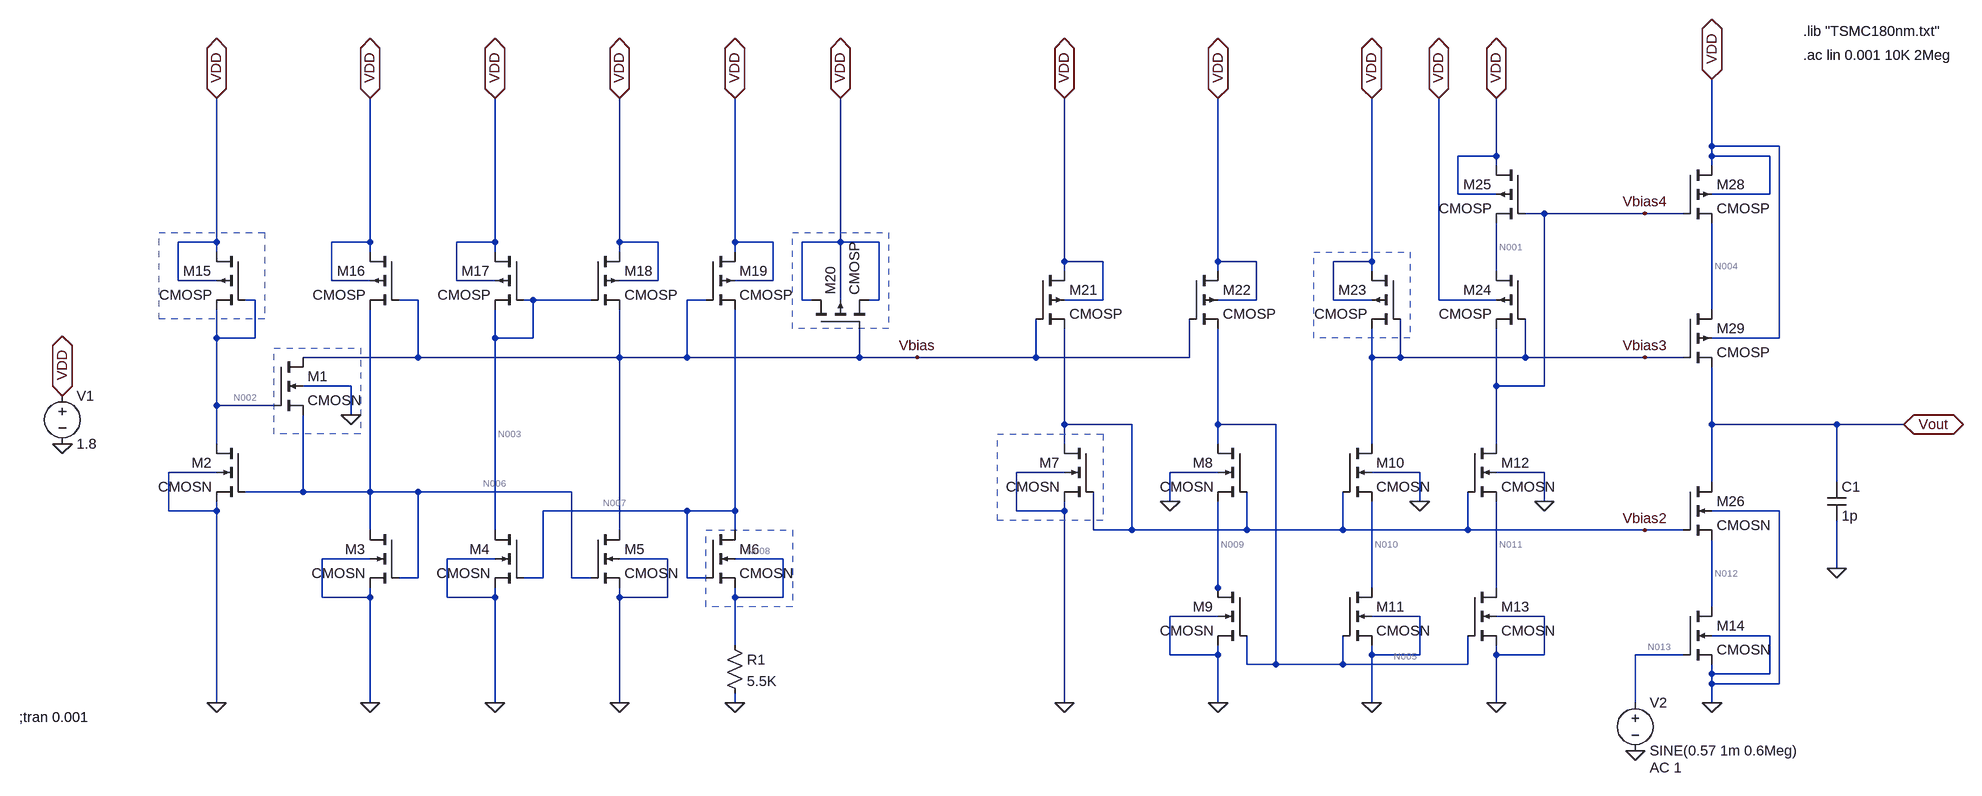
[diagram p0: schematic 180nmSpice.asc]
180nmSpice.asc, the LTspice schematic file:
Version 4
SHEET 1 3488 724
WIRE 2336 -368 2336 -480
WIRE 2448 -368 2336 -368
WIRE 1840 -352 1840 -448
WIRE 1840 -352 1776 -352
WIRE 2336 -352 2336 -368
WIRE 2432 -352 2336 -352
WIRE 1840 -336 1840 -352
WIRE 2336 -336 2336 -352
WIRE 1776 -288 1776 -352
WIRE 1840 -288 1776 -288
WIRE 2432 -288 2432 -352
WIRE 2432 -288 2336 -288
WIRE 1920 -256 1888 -256
WIRE 2224 -256 1920 -256
WIRE 2288 -256 2224 -256
WIRE -352 -208 -352 -448
WIRE -352 -208 -416 -208
WIRE -96 -208 -96 -448
WIRE -96 -208 -160 -208
WIRE 112 -208 112 -448
WIRE 112 -208 48 -208
WIRE 320 -208 320 -448
WIRE 384 -208 320 -208
WIRE 512 -208 512 -448
WIRE 576 -208 512 -208
WIRE 688 -208 688 -448
WIRE 688 -208 624 -208
WIRE 752 -208 688 -208
WIRE -352 -192 -352 -208
WIRE -96 -192 -96 -208
WIRE 112 -192 112 -208
WIRE 320 -192 320 -208
WIRE 512 -192 512 -208
WIRE 1120 -176 1120 -448
WIRE 1184 -176 1120 -176
WIRE 1376 -176 1376 -448
WIRE 1440 -176 1376 -176
WIRE 1632 -176 1632 -448
WIRE 1632 -176 1568 -176
WIRE 1120 -160 1120 -176
WIRE 1376 -160 1376 -176
WIRE 1632 -160 1632 -176
WIRE 1840 -160 1840 -240
WIRE -416 -144 -416 -208
WIRE -352 -144 -416 -144
WIRE -160 -144 -160 -208
WIRE -96 -144 -160 -144
WIRE 48 -144 48 -208
WIRE 112 -144 48 -144
WIRE 384 -144 384 -208
WIRE 384 -144 320 -144
WIRE 576 -144 576 -208
WIRE 576 -144 512 -144
WIRE -288 -112 -304 -112
WIRE -16 -112 -48 -112
WIRE 176 -112 160 -112
WIRE 272 -112 176 -112
WIRE 464 -112 432 -112
WIRE 624 -112 624 -208
WIRE 640 -112 624 -112
WIRE 688 -112 688 -208
WIRE 752 -112 752 -208
WIRE 752 -112 736 -112
WIRE 1184 -112 1184 -176
WIRE 1184 -112 1120 -112
WIRE 1440 -112 1440 -176
WIRE 1440 -112 1376 -112
WIRE 1568 -112 1568 -176
WIRE 1632 -112 1568 -112
WIRE 1744 -112 1744 -448
WIRE 1840 -112 1744 -112
WIRE 2336 -96 2336 -240
WIRE -352 -48 -352 -96
WIRE -288 -48 -288 -112
WIRE -288 -48 -352 -48
WIRE 112 -48 112 -96
WIRE 176 -48 176 -112
WIRE 176 -48 112 -48
WIRE 2448 -48 2448 -368
WIRE 2448 -48 2336 -48
WIRE -16 -16 -16 -112
WIRE -16 -16 -208 -16
WIRE 320 -16 320 -96
WIRE 320 -16 -16 -16
WIRE 432 -16 432 -112
WIRE 432 -16 320 -16
WIRE 720 -16 720 -64
WIRE 720 -16 432 -16
WIRE 816 -16 720 -16
WIRE 1072 -16 1072 -80
WIRE 1072 -16 816 -16
WIRE 1328 -16 1328 -80
WIRE 1328 -16 1072 -16
WIRE 1632 -16 1632 -64
WIRE 1680 -16 1680 -80
WIRE 1680 -16 1632 -16
WIRE 1888 -16 1888 -80
WIRE 1888 -16 1680 -16
WIRE 2224 -16 1888 -16
WIRE 2288 -16 2224 -16
WIRE -128 32 -208 32
WIRE 1840 32 1840 -64
WIRE 1920 32 1920 -256
WIRE 1920 32 1840 32
WIRE -352 64 -352 -48
WIRE -256 64 -352 64
WIRE -128 80 -128 32
WIRE 1120 96 1120 -64
WIRE 1232 96 1120 96
WIRE 1376 96 1376 -64
WIRE 1472 96 1376 96
WIRE 2336 96 2336 0
WIRE 2544 96 2336 96
WIRE 2656 96 2544 96
WIRE -352 128 -352 64
WIRE 1120 128 1120 96
WIRE 1376 128 1376 96
WIRE 1632 128 1632 -16
WIRE 1840 128 1840 32
WIRE -352 176 -432 176
WIRE 1120 176 1040 176
WIRE 1376 176 1296 176
WIRE 1712 176 1632 176
WIRE 1920 176 1840 176
WIRE 2336 192 2336 96
WIRE 2544 192 2544 96
WIRE -208 208 -208 80
WIRE -208 208 -304 208
WIRE -96 208 -96 -96
WIRE -96 208 -208 208
WIRE -16 208 -96 208
WIRE 240 208 -16 208
WIRE 1296 224 1296 176
WIRE 1712 224 1712 176
WIRE 1920 224 1920 176
WIRE -432 240 -432 176
WIRE -352 240 -352 224
WIRE -352 240 -432 240
WIRE 432 240 192 240
WIRE 512 240 512 -96
WIRE 512 240 432 240
WIRE 1040 240 1040 176
WIRE 1120 240 1120 224
WIRE 1120 240 1040 240
WIRE 2448 240 2336 240
WIRE -96 272 -96 208
WIRE 112 272 112 -48
WIRE 320 272 320 -16
WIRE 512 272 512 240
WIRE 1168 272 1168 208
WIRE 1232 272 1232 96
WIRE 1232 272 1168 272
WIRE 1424 272 1424 208
WIRE 1424 272 1232 272
WIRE 1584 272 1584 208
WIRE 1584 272 1424 272
WIRE 1792 272 1792 208
WIRE 1792 272 1584 272
WIRE 2224 272 1792 272
WIRE 2288 272 2224 272
WIRE -96 320 -176 320
WIRE 112 320 32 320
WIRE 400 320 320 320
WIRE 592 320 512 320
WIRE 2544 336 2544 256
WIRE -16 352 -16 208
WIRE -16 352 -48 352
WIRE 192 352 192 240
WIRE 192 352 160 352
WIRE 240 352 240 208
WIRE 272 352 240 352
WIRE 432 352 432 240
WIRE 464 352 432 352
WIRE 1376 368 1376 224
WIRE 1632 368 1632 224
WIRE 1840 368 1840 224
WIRE -176 384 -176 320
WIRE -96 384 -96 368
WIRE -96 384 -176 384
WIRE 32 384 32 320
WIRE 112 384 112 368
WIRE 112 384 32 384
WIRE 320 384 320 368
WIRE 400 384 400 320
WIRE 400 384 320 384
WIRE 512 384 512 368
WIRE 592 384 592 320
WIRE 592 384 512 384
WIRE 1376 384 1376 368
WIRE 2336 400 2336 288
WIRE 1376 416 1296 416
WIRE 1712 416 1632 416
WIRE 1920 416 1840 416
WIRE 2432 448 2336 448
WIRE 512 464 512 384
WIRE 1296 480 1296 416
WIRE 1376 480 1376 464
WIRE 1376 480 1296 480
WIRE 1632 480 1632 464
WIRE 1712 480 1712 416
WIRE 1712 480 1632 480
WIRE 1840 480 1840 464
WIRE 1920 480 1920 416
WIRE 1920 480 1840 480
WIRE 2288 480 2208 480
WIRE 1424 496 1424 448
WIRE 1472 496 1472 96
WIRE 1472 496 1424 496
WIRE 1584 496 1584 448
WIRE 1584 496 1472 496
WIRE 1792 496 1792 448
WIRE 1792 496 1584 496
WIRE 2336 512 2336 496
WIRE 2432 512 2432 448
WIRE 2432 512 2336 512
WIRE 2336 528 2336 512
WIRE 2448 528 2448 240
WIRE 2448 528 2336 528
WIRE -352 560 -352 240
WIRE -96 560 -96 384
WIRE 112 560 112 384
WIRE 320 560 320 384
WIRE 512 560 512 544
WIRE 1120 560 1120 240
WIRE 1376 560 1376 480
WIRE 1632 560 1632 480
WIRE 1840 560 1840 480
WIRE 2208 560 2208 480
WIRE 2336 560 2336 528
FLAG -624 128 0
FLAG -624 48 VDD
IOPIN -624 48 BiDir
FLAG -352 -448 VDD
IOPIN -352 -448 BiDir
FLAG -96 -448 VDD
IOPIN -96 -448 BiDir
FLAG 112 -448 VDD
IOPIN 112 -448 BiDir
FLAG 320 -448 VDD
IOPIN 320 -448 BiDir
FLAG 512 -448 VDD
IOPIN 512 -448 BiDir
FLAG 688 -448 VDD
IOPIN 688 -448 BiDir
FLAG 1120 -448 VDD
IOPIN 1120 -448 BiDir
FLAG 1376 -448 VDD
IOPIN 1376 -448 BiDir
FLAG 1632 -448 VDD
IOPIN 1632 -448 BiDir
FLAG 1840 -448 VDD
IOPIN 1840 -448 BiDir
FLAG -352 560 0
FLAG -96 560 0
FLAG 112 560 0
FLAG 320 560 0
FLAG 512 560 0
FLAG 1120 560 0
FLAG 1376 560 0
FLAG 1632 560 0
FLAG 1840 560 0
FLAG 1920 224 0
FLAG 1712 224 0
FLAG 1296 224 0
FLAG -128 80 0
FLAG 1744 -448 VDD
IOPIN 1744 -448 BiDir
FLAG 2224 -256 Vbias4
FLAG 2224 -16 Vbias3
FLAG 2224 272 Vbias2
FLAG 2336 -480 VDD
IOPIN 2336 -480 BiDir
FLAG 2336 560 0
FLAG 2208 640 0
FLAG 2656 96 Vout
IOPIN 2656 96 BiDir
FLAG 2544 336 0
FLAG 816 -16 Vbias
DATAFLAG 2048 -256 ""
DATAFLAG 2048 -16 ""
DATAFLAG 2048 272 ""
DATAFLAG 944 -16 ""
DATAFLAG 2576 96 ""
DATAFLAG 2208 480 ""
SYMBOL nmos4 -256 -16 R0
SYMATTR InstName M1
SYMATTR Value CMOSN
SYMATTR Value2 l=360n w=720n
SYMBOL nmos4 -304 128 M0
SYMATTR InstName M2
SYMATTR Value CMOSN
SYMATTR Value2 l=360n w=1800n
SYMBOL nmos4 -48 272 M0
SYMATTR InstName M3
SYMATTR Value CMOSN
SYMATTR Value2 l=360n w=1800n
SYMBOL nmos4 160 272 M0
SYMATTR InstName M4
SYMATTR Value CMOSN
SYMATTR Value2 l=360n w=1800n
SYMBOL nmos4 272 272 R0
SYMATTR InstName M5
SYMATTR Value CMOSN
SYMATTR Value2 l=360n w=1800n
SYMBOL nmos4 464 272 R0
SYMATTR InstName M6
SYMATTR Value CMOSN
SYMATTR Value2 l=360n w=5400n
SYMBOL nmos4 1168 128 M0
SYMATTR InstName M7
SYMATTR Value CMOSN
SYMATTR Value2 l=540n w=686n
SYMBOL nmos4 1424 128 M0
SYMATTR InstName M8
SYMATTR Value CMOSN
SYMATTR Value2 l=360n w=1800n
SYMBOL nmos4 1424 368 M0
SYMATTR InstName M9
SYMATTR Value CMOSN
SYMATTR Value2 l=360n w=1800n
SYMBOL nmos4 1584 128 R0
SYMATTR InstName M10
SYMATTR Value CMOSN
SYMATTR Value2 l=360n w=1800n
SYMBOL nmos4 1584 368 R0
SYMATTR InstName M11
SYMATTR Value CMOSN
SYMATTR Value2 l=360n w=2600n
SYMBOL nmos4 1792 128 R0
SYMATTR InstName M12
SYMATTR Value CMOSN
SYMATTR Value2 l=360n w=1800n
SYMBOL nmos4 1792 368 R0
SYMATTR InstName M13
SYMATTR Value CMOSN
SYMATTR Value2 l=360n w=1800n
SYMBOL pmos4 -304 -192 M0
SYMATTR InstName M15
SYMATTR Value CMOSP
SYMATTR Value2 l=3600n w=1800n
SYMBOL pmos4 -48 -192 M0
SYMATTR InstName M16
SYMATTR Value CMOSP
SYMATTR Value2 l=360n w=4320n
SYMBOL pmos4 160 -192 M0
SYMATTR InstName M17
SYMATTR Value CMOSP
SYMATTR Value2 l=360n w=4320n
SYMBOL pmos4 272 -192 R0
SYMATTR InstName M18
SYMATTR Value CMOSP
SYMATTR Value2 l=360n w=4320n
SYMBOL pmos4 464 -192 R0
SYMATTR InstName M19
SYMATTR Value CMOSP
SYMATTR Value2 l=360n w=4320n
SYMBOL pmos4 640 -64 R270
SYMATTR InstName M20
SYMATTR Value CMOSP
SYMATTR Value2 l=9000n w=9000n
SYMBOL pmos4 1072 -160 R0
SYMATTR InstName M21
SYMATTR Value CMOSP
SYMATTR Value2 l=360n w=7380n
SYMBOL pmos4 1328 -160 R0
SYMATTR InstName M22
SYMATTR Value CMOSP
SYMATTR Value2 l=360n w=4320n
SYMBOL pmos4 1680 -160 M0
SYMATTR InstName M23
SYMATTR Value CMOSP
SYMATTR Value2 l=900n w=3600n
SYMBOL pmos4 1888 -160 M0
SYMATTR InstName M24
SYMATTR Value CMOSP
SYMATTR Value2 l=360n w=4320n
SYMBOL pmos4 1888 -336 M0
SYMATTR InstName M25
SYMATTR Value CMOSP
SYMATTR Value2 l=360n w=6840n
SYMBOL voltage -624 32 R0
WINDOW 123 0 0 Left 0
WINDOW 39 0 0 Left 0
SYMATTR InstName V1
SYMATTR Value 1.8
SYMBOL res 496 448 R0
SYMATTR InstName R1
SYMATTR Value 5.5K
SYMBOL voltage 2208 544 R0
WINDOW 123 24 124 Left 2
WINDOW 39 0 0 Left 0
SYMATTR Value2 AC 1
SYMATTR InstName V2
SYMATTR Value SINE(0.57 1m 0.6Meg)
SYMBOL nmos4 2288 400 R0
SYMATTR InstName M14
SYMATTR Value CMOSN
SYMATTR Value2 l=360n w=1400n
SYMBOL nmos4 2288 192 R0
SYMATTR InstName M26
SYMATTR Value CMOSN
SYMATTR Value2 l=360n w=1300n
SYMBOL pmos4 2288 -336 R0
SYMATTR InstName M28
SYMATTR Value CMOSP
SYMATTR Value2 l=360n w=3800n
SYMBOL pmos4 2288 -96 R0
SYMATTR InstName M29
SYMATTR Value CMOSP
SYMATTR Value2 l=360n w=3700n
SYMBOL cap 2528 192 R0
SYMATTR InstName C1
SYMATTR Value 1p
TEXT -696 584 Left 2 !;tran 0.001
TEXT 2488 -560 Left 2 !.lib "TSMC180nm.txt"
TEXT 2488 -520 Left 2 !.ac lin 0.001 10K 2Meg
RECTANGLE Normal -272 -80 -448 -224 2
RECTANGLE Normal -112 112 -256 -32 2
RECTANGLE Normal 608 400 464 272 2
RECTANGLE Normal 768 -64 608 -224 2
RECTANGLE Normal 1184 256 1008 112 2
RECTANGLE Normal 1696 -48 1536 -192 2

The netlist it stands for:
* 180nmSpice.asc
M1 Vbias N002 N006 0 CMOSN l=360n w=720n
M2 N002 N006 0 0 CMOSN l=360n w=1800n
M3 N006 N006 0 0 CMOSN l=360n w=1800n
M4 N003 N007 0 0 CMOSN l=360n w=1800n
M5 Vbias N006 0 0 CMOSN l=360n w=1800n
M6 N007 N007 N008 N008 CMOSN l=360n w=5400n
M7 Vbias2 Vbias2 0 0 CMOSN l=540n w=686n
M8 N005 Vbias2 N009 0 CMOSN l=360n w=1800n
M9 N009 N005 0 0 CMOSN l=360n w=1800n
M10 Vbias3 Vbias2 N010 0 CMOSN l=360n w=1800n
M11 N010 N005 0 0 CMOSN l=360n w=2600n
M12 Vbias4 Vbias2 N011 0 CMOSN l=360n w=1800n
M13 N011 N005 0 0 CMOSN l=360n w=1800n
M15 VDD N002 N002 VDD CMOSP l=3600n w=1800n
M16 VDD Vbias N006 VDD CMOSP l=360n w=4320n
M17 VDD N003 N003 VDD CMOSP l=360n w=4320n
M18 VDD N003 Vbias VDD CMOSP l=360n w=4320n
M19 VDD Vbias N007 VDD CMOSP l=360n w=4320n
M20 VDD Vbias VDD VDD CMOSP l=9000n w=9000n
M21 VDD Vbias Vbias2 VDD CMOSP l=360n w=7380n
M22 VDD Vbias N005 VDD CMOSP l=360n w=4320n
M23 VDD Vbias3 Vbias3 VDD CMOSP l=900n w=3600n
M24 N001 Vbias3 Vbias4 VDD CMOSP l=360n w=4320n
M25 VDD Vbias4 N001 VDD CMOSP l=360n w=6840n
V1 VDD 0 1.8
R1 N008 0 5.5K
V2 N013 0 SINE(0.57 1m 0.6Meg) AC 1
M14 N012 N013 0 0 CMOSN l=360n w=1400n
M26 Vout Vbias2 N012 0 CMOSN l=360n w=1300n
M28 VDD Vbias4 N004 VDD CMOSP l=360n w=3800n
M29 N004 Vbias3 Vout VDD CMOSP l=360n w=3700n
C1 Vout 0 1p
.model NMOS NMOS
.model PMOS PMOS
.lib standard.mos
;tran 0.001
.lib "TSMC180nm.txt"
.ac lin 0.001 10K 2Meg
.backanno
.end

* Results of the author's LTspice run, read from the files saved beside the schematic
* Operating Point, zero values left out:
*   V(vbias) = 1.197 V
*   V(n002) = 443.6 mV
*   V(n006) = 581.1 mV
*   V(n003) = 1.183 V
*   V(n007) = 581.4 mV
*   V(n008) = 61.29 mV
*   V(vbias2) = 770.3 mV
*   V(n005) = 591.8 mV
*   V(n009) = 148 mV
*   V(vbias3) = 1.013 V
*   V(n010) = 133.3 mV
*   V(vbias4) = 1.215 V
*   V(n011) = 153.2 mV
*   V(vdd) = 1.8 V
*   V(n001) = 1.664 V
*   V(n013) = 570 mV
*   V(n012) = 142.4 mV
*   V(vout) = 221.4 mV
*   V(n004) = 1.632 V
*   Id(M1) = 1.207 pA
*   Ib(M1) = -1.798 pA
*   Id(M2) = 10.86 µA
*   Is(M2) = -10.86 µA
*   Id(M3) = 11.14 µA
*   Is(M3) = -11.14 µA
*   Id(M4) = 12.23 µA
*   Ib(M4) = -1.193 pA
*   Is(M4) = -12.23 µA
*   Id(M5) = 12.21 µA
*   Ib(M5) = -1.207 pA
*   Is(M5) = -12.21 µA
*   Id(M6) = 11.14 µA
*   Is(M6) = -11.14 µA
*   Id(M7) = 18.56 µA
*   Is(M7) = -18.56 µA
*   Id(M8) = 11.13 µA
*   Is(M8) = -11.13 µA
*   Id(M9) = 11.13 µA
*   Is(M9) = -11.13 µA
*   Id(M10) = 15.33 µA
*   Ib(M10) = -1.166 pA
*   Is(M10) = -15.33 µA
*   Id(M11) = 15.33 µA
*   Is(M11) = -15.33 µA
*   Id(M12) = 11.2 µA
*   Ib(M12) = -1.388 pA
*   Is(M12) = -11.2 µA
*   Id(M13) = 11.2 µA
*   Is(M13) = -11.2 µA
*   Id(M14) = 6.51 µA
*   Is(M14) = -6.51 µA
*   Id(M26) = 6.51 µA
*   Is(M26) = -6.51 µA
*   Id(M15) = 10.86 µA
*   Ib(M15) = 1.366 pA
*   Is(M15) = -10.86 µA
*   Id(M16) = 11.14 µA
*   Ib(M16) = 1.229 pA
*   Is(M16) = -11.14 µA
*   Id(M17) = 12.23 µA
*   Is(M17) = -12.23 µA
*   Id(M18) = 12.21 µA
*   Is(M18) = -12.21 µA
*   Id(M19) = 11.14 µA
*   Ib(M19) = 1.229 pA
*   Is(M19) = -11.14 µA
*   Id(M21) = 18.56 µA
*   Ib(M21) = 1.04 pA
*   Is(M21) = -18.56 µA
*   Id(M22) = 11.13 µA
*   Ib(M22) = 1.218 pA
*   Is(M22) = -11.13 µA
*   Id(M23) = 15.33 µA
*   Is(M23) = -15.33 µA
*   Id(M24) = 11.2 µA
*   Is(M24) = -11.2 µA
*   Id(M25) = 11.2 µA
*   Is(M25) = -11.2 µA
*   Id(M28) = 6.51 µA
*   Is(M28) = -6.51 µA
*   Id(M29) = 6.51 µA
*   Ib(M29) = 1.766 pA
*   Is(M29) = -6.51 µA
*   I(R1) = 11.14 µA
*   I(V1) = -120.3 µA
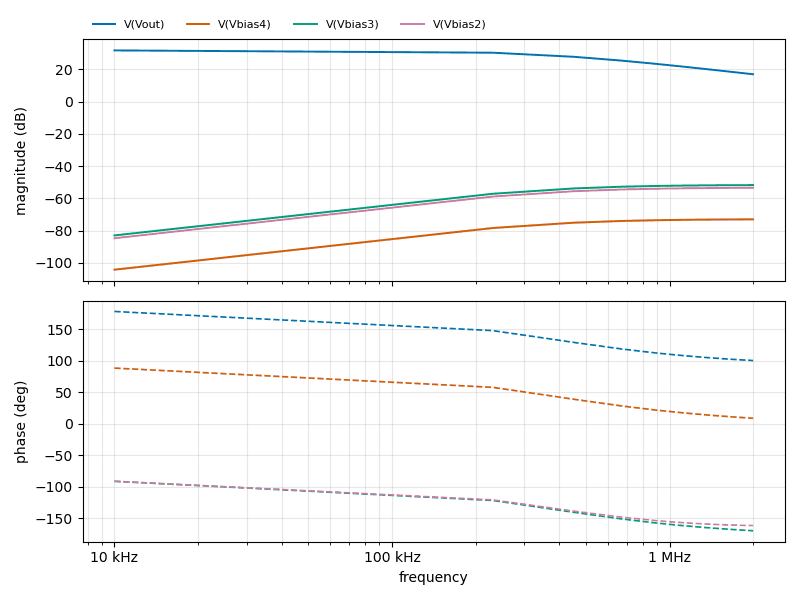
[diagram p1: AC Analysis of 180nmSpice.asc, plotted from the saved traces]
* AC Analysis, 1 run:
*   V(Vout): 31.78 dB at 10 kHz, 16.98 dB at 2 MHz, peak 31.78 dB at 10 kHz, 3 dB below the peak at 351.3 kHz
*   V(Vbias4): -104.21 dB at 10 kHz, -72.99 dB at 2 MHz, peak -72.99 dB at 2 MHz, 3 dB below the peak at 373.9 kHz
*   V(Vbias3): -82.96 dB at 10 kHz, -51.74 dB at 2 MHz, peak -51.74 dB at 2 MHz, 3 dB below the peak at 374.1 kHz
*   V(Vbias2): -84.70 dB at 10 kHz, -53.39 dB at 2 MHz, peak -53.39 dB at 2 MHz, 3 dB below the peak at 380 kHz